# Altium schematic sheet 06_KEY.SchDoc: KEY
size A4; Date: 20/11/2014; Author: HuangRui <vowstar@gmail.com>; DrawnBy: JiYaping <jyp1817@gmail.com>; Organization: WWW.NODEMCU.COM
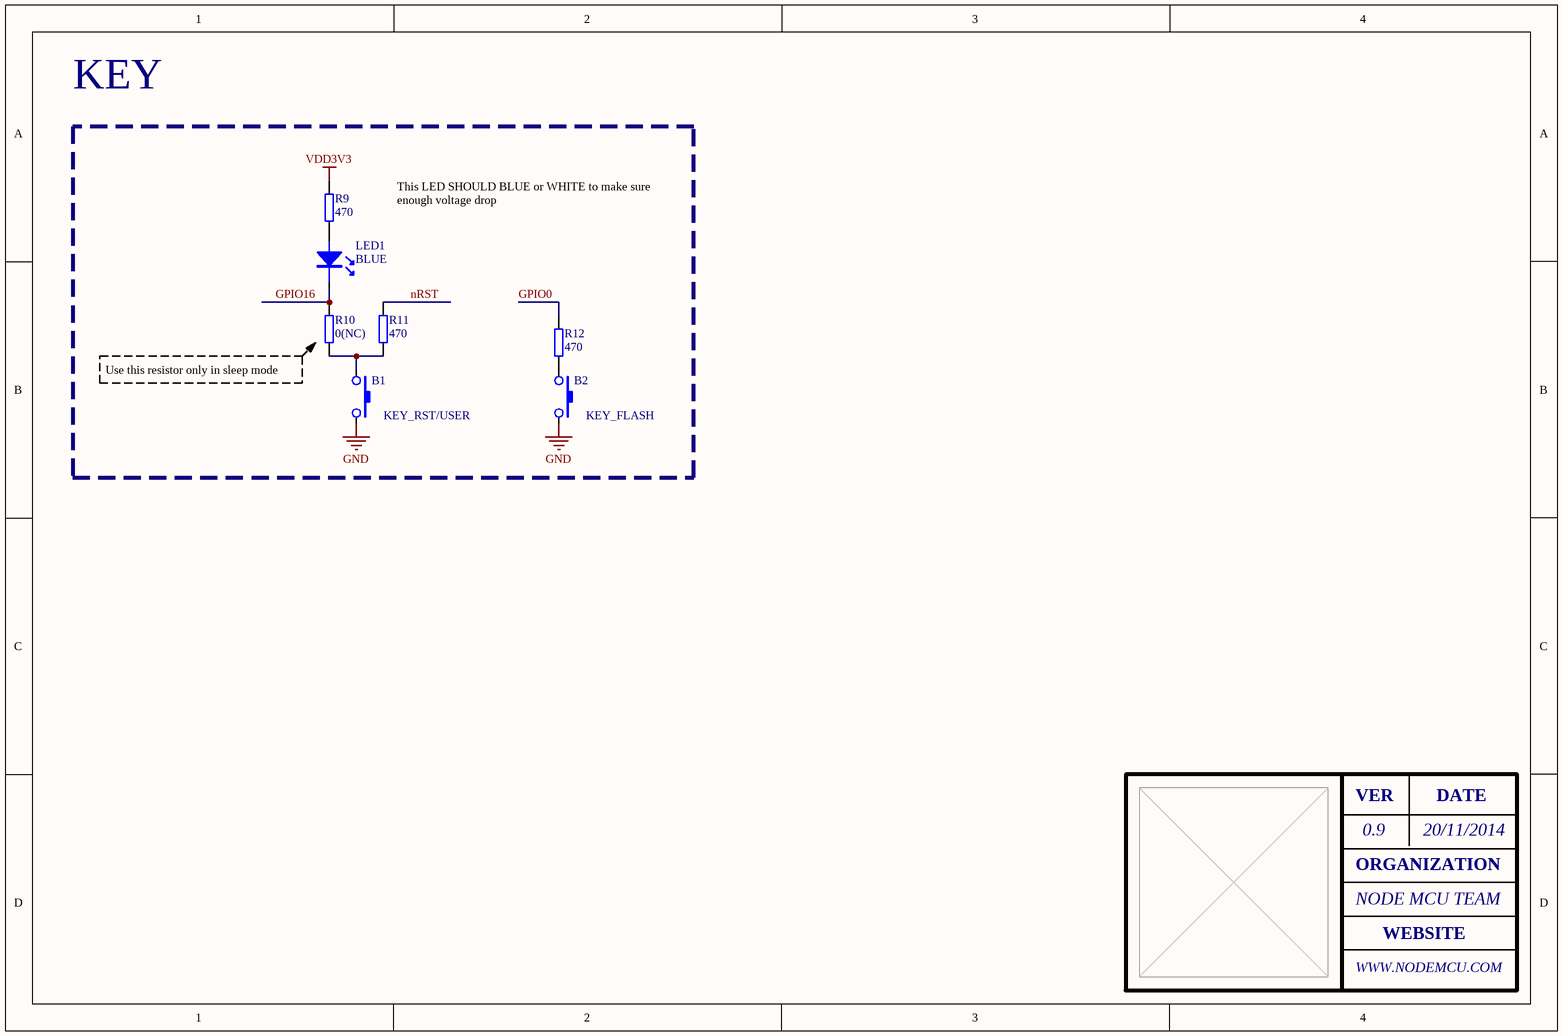
[diagram p0: 06_KEY.SchDoc]

## Parts
B1  KEY_RST/USER  [SMT_SW_PTS_820]
B2  KEY_FLASH  [SMT_SW_PTS_820]
LED1  BLUE  [SMT_LED_0603]
R9  470  [SMT_R_0402]
R10  0(NC)  [SMT_R_0402]
R11  470  [SMT_R_0402]
R12  470  [SMT_R_0402]

## Nets
GND: B1.2 B2.2
VDD3V3: R9.2
GPIO0: R12.2
GPIO16: LED1.2(K) R10.2
nRST: R11.2
NetB1_1: B1.1 R10.1 R11.1
NetB2_1: B2.1 R12.1
NetLED1_1: LED1.1(A) R9.1

## Notes on the sheet
- This LED SHOULD BLUE or WHITE to make sure enough voltage drop
- Use this resistor only in sleep mode
- VER
- 0.9
- DATE
- ORGANIZATION
- NODE MCU TEAM
- WEBSITE

## Library data of the parts
B1 B2 = SMT_SW_PTS_820: SMT Tactile ‎Switch PTS 820 Series
LED1 = SMT_LED_0603: SMT LED
R9-R12 = SMT_R_0402: Surface mount resistor 0402